# Altium schematic sheet FFT_Audio.SchDoc
size A; Organization: Altium Limited; Address1: L3, 12a Rodborough Rd; Address2: Frenchs Forest; Address3: NSW; Address4: Australia 2086; DocumentNumber: 1; SheetNumber: 1; SheetTotal: 1
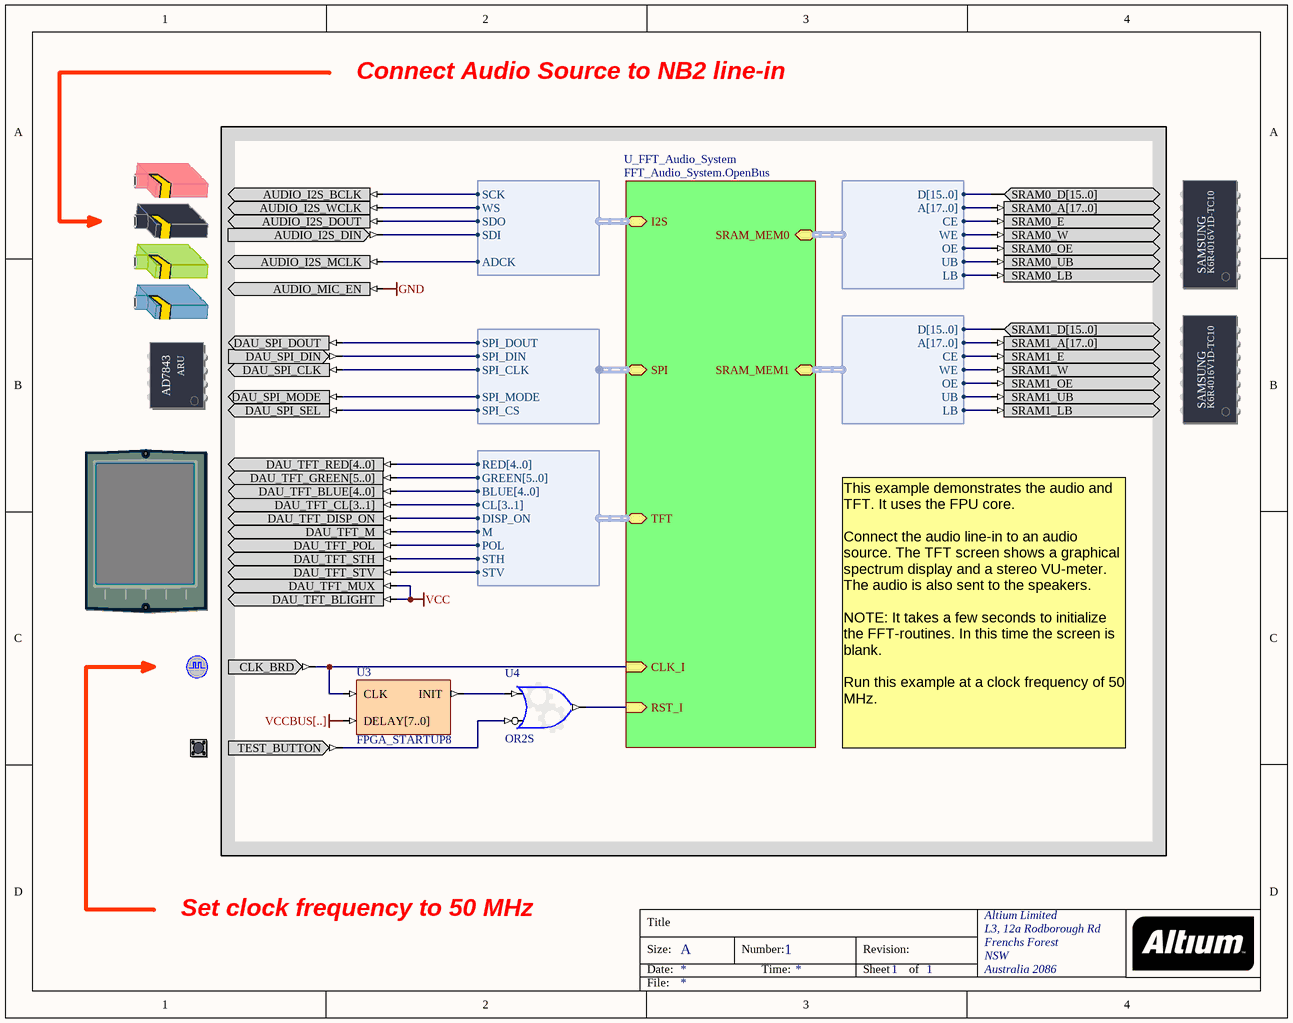
[diagram p0: FFT_Audio.SchDoc]

## Parts
(Parts that share a designator on the sheet are numbered #1, #2 ... from top to bottom, then left to right.)
?#1  AUDIO_CODEC  (value not drawn)
?#2  SRAM_DAUGHTER0  (value not drawn)
?#3  SRAM_DAUGHTER1  (value not drawn)
?#4  TOUCH_SCREEN_DIGITIZER  (value not drawn)
?#5  TFT_LCD  (value not drawn)
?#6  CLOCK_BOARD  (value not drawn)
?#7  TEST_BUTTON  (value not drawn)
U3  FPGA_STARTUP8
U4  OR2S

## Sub-sheets
U_FFT_Audio_System = FFT_Audio_System.OpenBus: RST_I (in), CLK_I (in), SPI (harness SPI_W_NB), I2S (harness I2S_W_Both), TFT (harness VGA32_TFT), SRAM_MEM0 (harness WB_MEM_CTRL_SRAM16_A18), SRAM_MEM1 (harness WB_MEM_CTRL_SRAM16_A18)

## Harnesses
VGA32_TFT: RED[4..0], GREEN[5..0], BLUE[4..0], CL[3..1], DISP_ON, M, POL, STH, STV
WB_MEM_CTRL_SRAM16_A18: D[15..0], A[17..0], CE, WE, OE, UB, LB
I2S_W_Both: SCK, WS, SDO, SDI, ADCK
SPI_W_NB: SPI_DOUT, SPI_DIN, SPI_CLK, SPI_MODE, SPI_CS

## Nets
GND: ?#1.AUDIO_MIC_EN
VCC: ?#5.DAU_TFT_BLIGHT ?#5.DAU_TFT_MUX
VCCBUS[..]: U3.DELAY[7..0]
Net?#1_AUDIO_I2S_BCLK: ?#1.AUDIO_I2S_BCLK ; sheet U_FFT_Audio_System/I2S.SCK
Net?#1_AUDIO_I2S_DIN: ?#1.AUDIO_I2S_DIN ; sheet U_FFT_Audio_System/I2S.SDI
Net?#1_AUDIO_I2S_DOUT: ?#1.AUDIO_I2S_DOUT ; sheet U_FFT_Audio_System/I2S.SDO
Net?#1_AUDIO_I2S_MCLK: ?#1.AUDIO_I2S_MCLK ; sheet U_FFT_Audio_System/I2S.ADCK
Net?#1_AUDIO_I2S_WCLK: ?#1.AUDIO_I2S_WCLK ; sheet U_FFT_Audio_System/I2S.WS
Net?#2_SRAM0_A[17..0]: ?#2.SRAM0_A[17..0] ; sheet U_FFT_Audio_System/SRAM_MEM0.A[17..0]
Net?#2_SRAM0_D[15..0]: ?#2.SRAM0_D[15..0] ; sheet U_FFT_Audio_System/SRAM_MEM0.D[15..0]
Net?#2_SRAM0_E: ?#2.SRAM0_E ; sheet U_FFT_Audio_System/SRAM_MEM0.CE
Net?#2_SRAM0_LB: ?#2.SRAM0_LB ; sheet U_FFT_Audio_System/SRAM_MEM0.LB
Net?#2_SRAM0_OE: ?#2.SRAM0_OE ; sheet U_FFT_Audio_System/SRAM_MEM0.OE
Net?#2_SRAM0_UB: ?#2.SRAM0_UB ; sheet U_FFT_Audio_System/SRAM_MEM0.UB
Net?#2_SRAM0_W: ?#2.SRAM0_W ; sheet U_FFT_Audio_System/SRAM_MEM0.WE
Net?#3_SRAM1_A[17..0]: ?#3.SRAM1_A[17..0] ; sheet U_FFT_Audio_System/SRAM_MEM1.A[17..0]
Net?#3_SRAM1_D[15..0]: ?#3.SRAM1_D[15..0] ; sheet U_FFT_Audio_System/SRAM_MEM1.D[15..0]
Net?#3_SRAM1_E: ?#3.SRAM1_E ; sheet U_FFT_Audio_System/SRAM_MEM1.CE
Net?#3_SRAM1_LB: ?#3.SRAM1_LB ; sheet U_FFT_Audio_System/SRAM_MEM1.LB
Net?#3_SRAM1_OE: ?#3.SRAM1_OE ; sheet U_FFT_Audio_System/SRAM_MEM1.OE
Net?#3_SRAM1_UB: ?#3.SRAM1_UB ; sheet U_FFT_Audio_System/SRAM_MEM1.UB
Net?#3_SRAM1_W: ?#3.SRAM1_W ; sheet U_FFT_Audio_System/SRAM_MEM1.WE
Net?#4_DAU_SPI_CLK: ?#4.DAU_SPI_CLK ; sheet U_FFT_Audio_System/SPI.SPI_CLK
Net?#4_DAU_SPI_DIN: ?#4.DAU_SPI_DIN ; sheet U_FFT_Audio_System/SPI.SPI_DIN
Net?#4_DAU_SPI_DOUT: ?#4.DAU_SPI_DOUT ; sheet U_FFT_Audio_System/SPI.SPI_DOUT
Net?#4_DAU_SPI_MODE: ?#4.DAU_SPI_MODE ; sheet U_FFT_Audio_System/SPI.SPI_MODE
Net?#4_DAU_SPI_SEL: ?#4.DAU_SPI_SEL ; sheet U_FFT_Audio_System/SPI.SPI_CS
Net?#5_DAU_TFT_BLUE[4..0]: ?#5.DAU_TFT_BLUE[4..0] ; sheet U_FFT_Audio_System/TFT.BLUE[4..0]
Net?#5_DAU_TFT_CL[3..1]: ?#5.DAU_TFT_CL[3..1] ; sheet U_FFT_Audio_System/TFT.CL[3..1]
Net?#5_DAU_TFT_DISP_ON: ?#5.DAU_TFT_DISP_ON ; sheet U_FFT_Audio_System/TFT.DISP_ON
Net?#5_DAU_TFT_GREEN[5..0]: ?#5.DAU_TFT_GREEN[5..0] ; sheet U_FFT_Audio_System/TFT.GREEN[5..0]
Net?#5_DAU_TFT_M: ?#5.DAU_TFT_M ; sheet U_FFT_Audio_System/TFT.M
Net?#5_DAU_TFT_POL: ?#5.DAU_TFT_POL ; sheet U_FFT_Audio_System/TFT.POL
Net?#5_DAU_TFT_RED[4..0]: ?#5.DAU_TFT_RED[4..0] ; sheet U_FFT_Audio_System/TFT.RED[4..0]
Net?#5_DAU_TFT_STH: ?#5.DAU_TFT_STH ; sheet U_FFT_Audio_System/TFT.STH
Net?#5_DAU_TFT_STV: ?#5.DAU_TFT_STV ; sheet U_FFT_Audio_System/TFT.STV
Net?#6_CLK_BRD: ?#6.CLK_BRD U3.CLK ; sheet U_FFT_Audio_System/CLK_I
Net?#7_TEST_BUTTON: ?#7.TEST_BUTTON U4.I1
NetU3_INIT: U3.INIT U4.I0
NetU4_O: U4.O ; sheet U_FFT_Audio_System/RST_I

## Notes on the sheet
- Connect Audio Source to NB2 line-in
- This example demonstrates the audio and TFT. It uses the FPU core.
  Connect the audio line-in to an audio source. The TFT screen shows a graphical spectrum display and a stereo VU-meter. The audio is also sent to the speakers.
  NOTE: It takes a few seconds to initialize the FFT-routines. In this time the screen is blank.
  Run this example at a clock frequency of 50 MHz.
- Set clock frequency to 50 MHz
- Title
- Size:
- Date:
- A
- Number:
- Time:
- Revision:
- Sheet
- of
- File:
- (in symbol SRAM_DAUGHTER0) SAMSUNG; K6R4016V1D-TC10
- (in symbol SRAM_DAUGHTER1) SAMSUNG; K6R4016V1D-TC10
- (in symbol TOUCH_SCREEN_DIGITIZER) ARU; AD7843

## Library data of the parts
?#1 = AUDIO_CODEC: Audio Codec; PortComponent: True; IncludeInDSF: AUDIO_CS4270; Published: 22-Jan-2007; Publisher: Altium Limited; HelpURL: TR0145 Technical Reference for Altium's Audio-Video Peripheral Board PB01.pdf#page=12
?#2 = SRAM_DAUGHTER0: Free Static RAM - Daughterboard; PortComponent: True; Published: 14-May-2007; Publisher: Altium Limited; HelpURL: TR0143 NanoBoard Technical Reference Manual - NB2.pdf#page=24
?#3 = SRAM_DAUGHTER1: Free Static RAM - Daughterboard; PortComponent: True; Published: 14-May-2007; Publisher: Altium Limited; HelpURL: TR0143 NanoBoard Technical Reference Manual - NB2.pdf#page=24
?#4 = TOUCH_SCREEN_DIGITIZER: Touch Screen Digitizer; PortComponent: True; Published: 22-Jan-2007; Publisher: Altium Limited; HelpURL: TR0143 NanoBoard Technical Reference Manual - NB2.pdf#page=43
?#5 = TFT_LCD: TFT LCD Panel; PortComponent: True; Published: 22-Jan-2007; Publisher: Altium Limited; HelpURL: TR0143 Technical Reference Manual for Altium's Desktop NanoBoard NB2DSK01.pdf#page=50
?#6 = CLOCK_BOARD: Global System Clock Supply; PortComponent: True; Published: 19-Nov-2003; Publisher: Altium Limited; HelpURL: TR0143 Technical Reference Manual for Altium's Desktop NanoBoard NB2DSK01.pdf#page=41; UseInDSF: True
?#7 = TEST_BUTTON: Test / Reset Button; PortComponent: True; Published: 19-Nov-2003; Publisher: Altium Limited; HelpURL: TR0143 Technical Reference Manual for Altium's Desktop NanoBoard NB2DSK01.pdf#page=53
U3 = FPGA_STARTUP8: FPGA Startup With 8 Bit Delay; Published: 9-Dec-2004; Publisher: Altium Limited; HelpURL: CR0119 FPGA_STARTUPx Powerup Delay Unit.pdf; LastRevisionNo: 1.00.00; ComponentLink1Description: Core &Resource Usage; ComponentLink1URL: CR0139 FPGA Peripheral Resource Usage.pdf#page=11
U4 = GATE: Configurable Generic Gate; ConfiguratorName: GENERIC_GATE; ConfigurationParameters: {}Version[1.0]{}GateKind[OR]{}BusInput[False]{}GateInputType[Bit]{}GateOutputOption[Normal]{}BusWidth[8]{}RegisterOutputs[False]{}NegativeClockEdge[False]{}InputCount[2]{}InputInvert0[False]{}InputInvert1[True]{}; LastRevisionNo: 1.00.00; Published: 3-Sep-2008; Publisher: Altium Limited